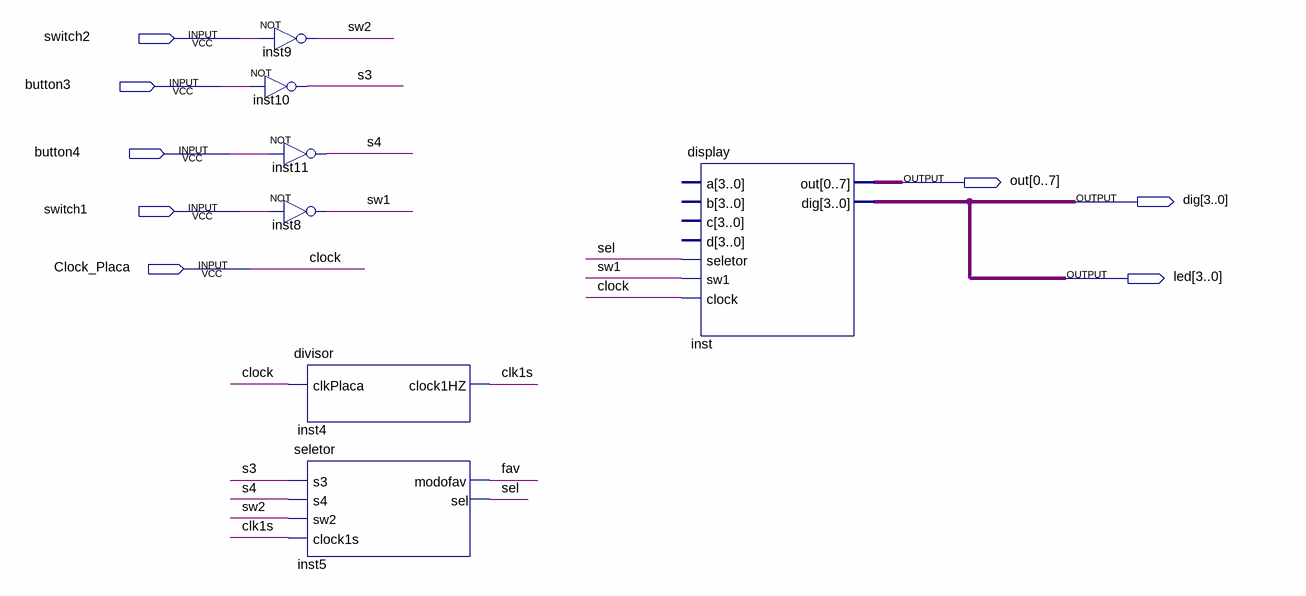
[diagram p0: schematic sheet]
// Quartus schematic testedisplay.bdf as structural Verilog: 7 symbols, 8 pins
module testedisplay (
  input  switch2,
  input  button3,
  input  button4,
  input  switch1,
  input  Clock_Placa,
  output [0:7] out,
  output [3:0] dig,
  output [3:0] led
);

  wire clk1s, fav, s3, s4, sel, sw1, sw2;

  not inst9 (sw2, switch2);
  not inst10 (s3, button3);
  not inst11 (s4, button4);
  not inst8 (sw1, switch1);
  divisor inst4 (.clkPlaca(Clock_Placa), .clock1HZ(clk1s));
  seletor inst5 (.s3(s3), .s4(s4), .sw2(sw2), .clock1s(clk1s), .modofav(fav), .sel(sel));
  display inst (.seletor(sel), .sw1(sw1), .clock(Clock_Placa), .out(out), .dig(dig));  // open: a, b, c, d

  assign led = dig;

  // Other names for the same wires on the sheet: clock = Clock_Placa
endmodule
